# EAGLE schematic USBHub (EAGLE 9.4.2)

## Sheet 1 of 2
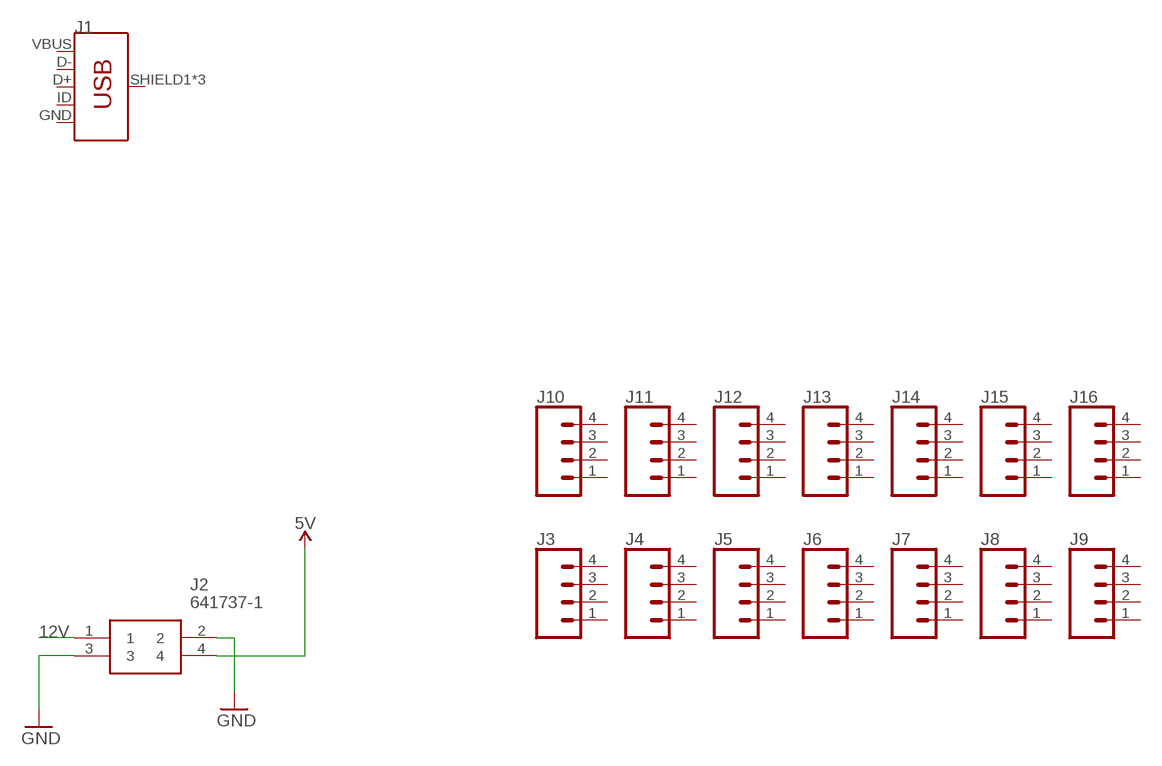
[diagram p0: schematic, sheet 1]

### Parts
J1  USB_MICRO-B_FEMALE-SMT  [USB-B-MICRO-SMD]
J2  641737-1  [641737-1]
J3  CONN_04JST-PTH-VERT  [JST-4-PTH-VERT]
J4  CONN_04JST-PTH-VERT  [JST-4-PTH-VERT]
J5  CONN_04JST-PTH-VERT  [JST-4-PTH-VERT]
J6  CONN_04JST-PTH-VERT  [JST-4-PTH-VERT]
J7  CONN_04JST-PTH-VERT  [JST-4-PTH-VERT]
J8  CONN_04JST-PTH-VERT  [JST-4-PTH-VERT]
J9  CONN_04JST-PTH-VERT  [JST-4-PTH-VERT]
J10  CONN_04JST-PTH-VERT  [JST-4-PTH-VERT]
J11  CONN_04JST-PTH-VERT  [JST-4-PTH-VERT]
J12  CONN_04JST-PTH-VERT  [JST-4-PTH-VERT]
J13  CONN_04JST-PTH-VERT  [JST-4-PTH-VERT]
J14  CONN_04JST-PTH-VERT  [JST-4-PTH-VERT]
J15  CONN_04JST-PTH-VERT  [JST-4-PTH-VERT]
J16  CONN_04JST-PTH-VERT  [JST-4-PTH-VERT]

### Nets
5V: J2.4
12V: J2.1
GND: J2.2 J2.3
Unconnected: J1.D+ J1.D- J1.ID J1.SHIELD1(SHIELD) J1.SHIELD2(SHIELD) J1.SHIELD3(SHIELD) J3.1 J3.2 J3.3 J3.4 J4.1 J4.2 J4.3 J4.4 J5.1 J5.2 J5.3 J5.4 J6.1 J6.2 J6.3 J6.4 J7.1 J7.2 J7.3 J7.4 J8.1 J8.2 J8.3 J8.4 J9.1 J9.2 J9.3 J9.4 J10.1 J10.2 J10.3 J10.4 J11.1 J11.2 J11.3 J11.4 J12.1 J12.2 J12.3 J12.4 J13.1 J13.2 J13.3 J13.4 J14.1 J14.2 J14.3 J14.4 J15.1 J15.2 J15.3 J15.4 J16.1 J16.2 J16.3 J16.4

## Sheet 2 of 2
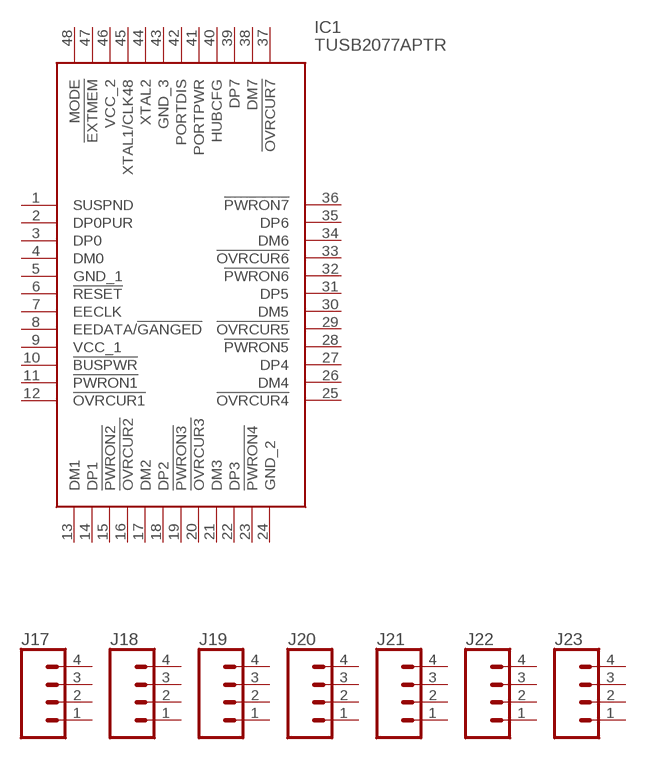
[diagram p1: schematic, sheet 2]

### Parts
IC1  TUSB2077APTR  [QFP50P900X900X160-48N]
J17  CONN_04JST-PTH-VERT  [JST-4-PTH-VERT]
J18  CONN_04JST-PTH-VERT  [JST-4-PTH-VERT]
J19  CONN_04JST-PTH-VERT  [JST-4-PTH-VERT]
J20  CONN_04JST-PTH-VERT  [JST-4-PTH-VERT]
J21  CONN_04JST-PTH-VERT  [JST-4-PTH-VERT]
J22  CONN_04JST-PTH-VERT  [JST-4-PTH-VERT]
J23  CONN_04JST-PTH-VERT  [JST-4-PTH-VERT]
Unconnected: IC1.1(SUSPND) IC1.2(DP0PUR) IC1.3(DP0) IC1.4(DM0) IC1.5(GND_1) IC1.6(!RESET) IC1.7(EECLK) IC1.8(EEDATA/!GANGED) IC1.9(VCC_1) IC1.10(!BUSPWR) IC1.11(!PWRON1) IC1.12(!OVRCUR1) IC1.13(DM1) IC1.14(DP1) IC1.15(!PWRON2) IC1.16(!OVRCUR2) IC1.17(DM2) IC1.18(DP2) IC1.19(!PWRON3) IC1.20(!OVRCUR3) IC1.21(DM3) IC1.22(DP3) IC1.23(!PWRON4) IC1.24(GND_2) IC1.25(!OVRCUR4) IC1.26(DM4) IC1.27(DP4) IC1.28(!PWRON5) IC1.29(!OVRCUR5) IC1.30(DM5) IC1.31(DP5) IC1.32(!PWRON6) IC1.33(!OVRCUR6) IC1.34(DM6) IC1.35(DP6) IC1.36(!PWRON7) IC1.37(!OVRCUR7) IC1.38(DM7) IC1.39(DP7) IC1.40(HUBCFG) IC1.41(PORTPWR) IC1.42(PORTDIS) IC1.43(GND_3) IC1.44(XTAL2) IC1.45(XTAL1/CLK48) IC1.46(VCC_2) IC1.47(!EXTMEM) IC1.48(MODE) J17.1 J17.2 J17.3 J17.4 J18.1 J18.2 J18.3 J18.4 J19.1 J19.2 J19.3 J19.4 J20.1 J20.2 J20.3 J20.4 J21.1 J21.2 J21.3 J21.4 J22.1 J22.2 J22.3 J22.4 J23.1 J23.2 J23.3 J23.4

## Power pins joined to a net without a drawn wire
GND: J1.GND
VBUS: J1.VBUS

## Library data of the parts
IC1 = SamacSys_Parts:TUSB2077APTR: 7-Port Full-Speed 12Mbps USB 2.0 Hub Source: Datasheet <http://www.ti.com/lit/gpn/TUSB2077A>; DESCRIPTION: 7-Port Full-Speed 12Mbps USB 2.0 Hub; HEIGHT: 1.6mm; MANUFACTURER_NAME: Texas Instruments; MANUFACTURER_PART_NUMBER: TUSB2077APTR; MOUSER_PART_NUMBER: 595-TUSB2077APTR; MOUSER_PRICE-STOCK: https://www.mouser.com/Search/Refine.aspx?Keyword=595-TUSB2077APTR
J1 = SparkFun-Connectors:USB_MICRO-B: USB Type Micro-B Connector Male/female and PTH/SMT variants SparkFun Products: SparkFun microB USB Breakout <https://www.sparkfun.com/products/12035> SparkFun USB microB Plug Breakout <https://www.sparkfun.com/products/10031> SparkFun ESP8266 Thing <https://www.sparkfun.com/products/13231>; PROD_ID: CONN-11752
J2 = SamacSys_Parts:641737-1: 4w pcb mount R/A Pin Header Source: Datasheet <https://componentsearchengine.com/Datasheets/1/641737-1.pdf>; DESCRIPTION: 4w pcb mount R/A Pin Header; HEIGHT: mm; MANUFACTURER_NAME: TE Connectivity; MANUFACTURER_PART_NUMBER: 641737-1; MOUSER_PART_NUMBER: 571-6417371; MOUSER_PRICE-STOCK: https://www.mouser.com/Search/Refine.aspx?Keyword=571-6417371
J3-J23 = SparkFun-Connectors:CONN_04: Multi connection point. Often used as Generic Header-pin footprint for 0.1 inch spaced/style header connections On any of the 0.1 inch spaced packages, you can populate with these: Break Away Headers - Straight <https://www.sparkfun.com/products/116> (PRT-00116) Break Away Male Headers - Right Angle <https://www.sparkfun.com/products/553> (PRT-00553) Female Headers <https://www.sparkfun.com/products/115> (PRT-00115) Break Away Headers - Machine Pin <https://www.sparkfun.com/products/117> (PRT-00117) Break Away Female Headers - Swiss Machine Pin <https://www.sparkfun.com/products/743> (PRT-00743) For SCREWTERMINALS and SPRING TERMINALS visit here: Screw Terimnals on SparkFun.com <https://www.sparkfun.com/search/results?term=Screw+Terminals> (5mm/3.5mm/2.54mm spacing) This device is also useful as a general connection point to wire up your design to another part of your project. Our various solder wires solder well into these plated through hole pads. Hook-Up Wire - Assortment (Stranded, 22 AWG) <https://www.sparkfun.com/products/11375> (PRT-11375) Hook-Up Wire - Assortment (Solid Core, 22 AWG) <https://www.sparkfun.com/products/11367> (PRT-11367) View the entire wire category on our website here <https://www.sparkfun.com/categories/141> Special notes: Molex polarized connector foot print use with SKU : PRT-08231 with associated crimp pins and housings. 1MM SMD Version SKU: PRT-10208; PROD_ID: CONN-13251